# Altium schematic sheet Power Supply.SchDoc
size A4
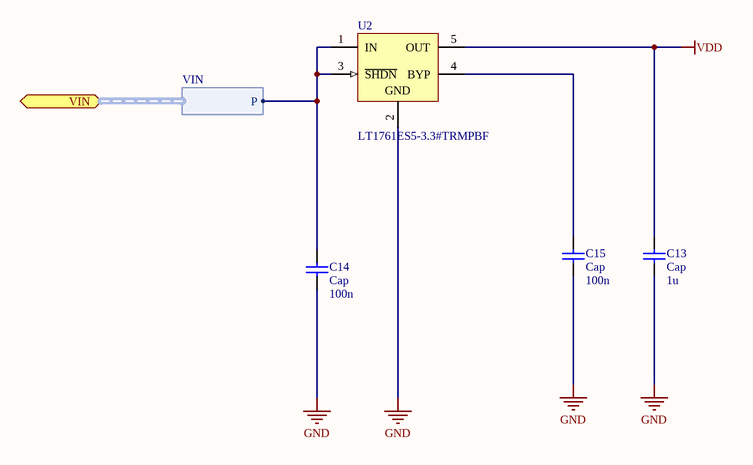
[diagram p0: Power Supply.SchDoc]

## Parts
C13  Cap  value 1u  [RAD-0.3]
C14  Cap  value 100n  [RAD-0.3]
C15  Cap  value 100n  [RAD-0.3]
U2  LT1761ES5-3.3#TRMPBF  [LT-S5-5-TSOT-23_N]

## Ports
VIN (harness VIN)

## Harnesses
VIN: P

## Nets
GND: C13.1 C14.1 C15.1 U2.2(GND)
VDD: C13.2 U2.5(OUT)
NetC14_2: C14.2 U2.1(IN) U2.3(~{SHDN}) ; port VIN.P
NetC15_2: C15.2 U2.4(BYP)

## Library data of the parts
C13-C15 = Cap: Capacitor; Published: 8-Jun-2000; LatestRevisionDate: 17-Jul-2002; LatestRevisionNote: Re-released for DXP Platform.; PackageReference: RAD-0.3; Publisher: Altium Limited; PackageDescription: Radial Cap, Thru-Hole; 2 Leads; 0.3 in Pin Spacing
U2 = CMP-0476-01224-1: 100 mA, Low Noise, LDO Micropower Regulator, 1.8 to 20 V Vin, 3.3 V Vout, 5-pin SOT23 (S5-5), -40 to 125 degC, Pb-Free, Mini Tape and Reel; Manufacturer: Linear Technology; Number of Outputs: 1; Iout(mA): 100; Isupply(mA): 0.02; Dropout Voltage(V): 0.3; Noise(uV): 20; PSRR(dB): 65; Discrete Pass Element: no; Vin Min(V): 1.8; Output Voltage: 3.3 V; Code_JEDEC: MO-193; Mounting Technology: Surface Mount; ComponentLink2Description: Datasheet; PackageReference: S5-5; PackageVersion: Jun-10; ComponentLink1Description: Manufacturer URL; ComponentLink3URL: http://cds.linear.com/docs/en/packaging/SOT_5_05-08-1635.pdf; RoHS: TRUE; ComponentLink3Description: Package Specification; Shutdown Current(uA): 1; ComponentLink1URL: http://www.linear.com/; Vin Max(V): 20; PackageDescription: 5-Pin Plastic TSOT-23, Body 1.63 x 2.90 mm, Pitch 0.95 mm; PartNumber: LT1761ES5-3.3#TRMPBF; DatasheetVersion: Rev. F; Packing: Mini Tape and Reel; ComponentLink2URL: http://cds.linear.com/docs/en/datasheet/1761sff.pdf